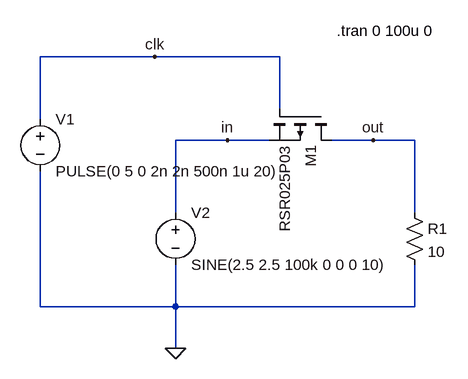
[diagram p0: schematic priklad1.1.asc]
priklad1.1.asc, the LTspice schematic file:
Version 4
SHEET 1 880 680
WIRE -336 -224 -512 -224
WIRE -144 -224 -336 -224
WIRE -144 -144 -144 -224
WIRE -512 -128 -512 -224
WIRE -224 -96 -304 -96
WIRE -160 -96 -224 -96
WIRE 0 -96 -64 -96
WIRE 64 -96 0 -96
WIRE -304 16 -304 -96
WIRE 64 16 64 -96
WIRE -512 160 -512 -48
WIRE -304 160 -304 96
WIRE -304 160 -512 160
WIRE 64 160 64 96
WIRE 64 160 -304 160
WIRE -304 224 -304 160
FLAG -224 -96 in
FLAG 0 -96 out
FLAG -336 -224 clk
FLAG -304 224 0
SYMBOL voltage -304 0 R0
WINDOW 123 0 0 Left 2
WINDOW 39 0 0 Left 2
SYMATTR InstName V2
SYMATTR Value SINE(2.5 2.5 100k 0 0 0 10)
SYMBOL voltage -512 -144 R0
WINDOW 123 0 0 Left 2
WINDOW 39 0 0 Left 2
SYMATTR InstName V1
SYMATTR Value PULSE(0 5 0 2n 2n 500n 1u 20)
SYMBOL pmos -64 -144 R90
SYMATTR InstName M1
SYMATTR Value RSR025P03
SYMBOL res 48 0 R0
SYMATTR InstName R1
SYMATTR Value 10
TEXT -56 -264 Left 2 !.tran 0 100u 0

The netlist it stands for:
* priklad1.1.asc
V2 in 0 SINE(2.5 2.5 100k 0 0 0 10)
V1 clk 0 PULSE(0 5 0 2n 2n 500n 1u 20)
M1 out clk in in RSR025P03
R1 out 0 10
.model NMOS NMOS
.model PMOS PMOS
.lib standard.mos
.tran 0 100u 0
.backanno
.end